# EAGLE design shield (EAGLE 8.2.2)

## Sheet 1 of 2: power
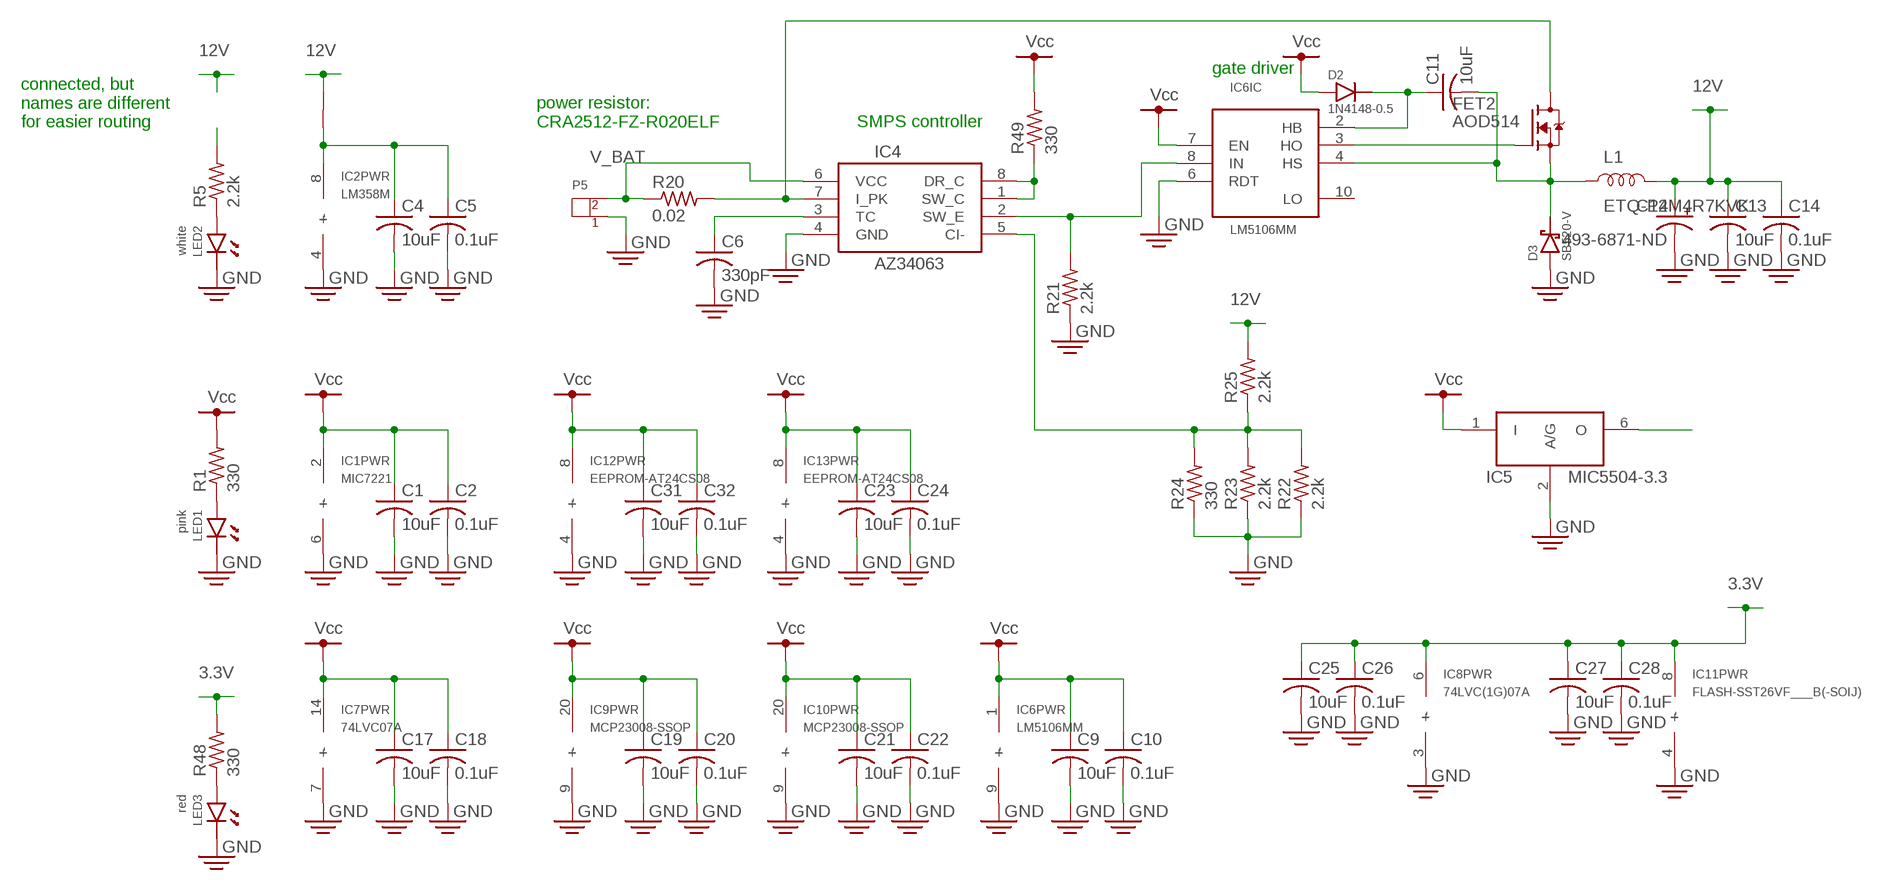
[diagram p0: schematic, sheet 1]

### Parts
-1  SEPERATOR  [SEPERATOR]
C1  10uF  C-USC0805  [C0805]
C2  0.1uF  C-USC0603  [C0603]
C4  10uF  C-USC0805  [C0805]
C5  0.1uF  C-USC0603  [C0603]
C6  330pF  C-USC0603  [C0603]
C9  10uF  C-USC0805  [C0805]
C10  0.1uF  C-USC0603  [C0603]
C11  10uF  C-USC0805  [C0805]
C12  493-6871-ND  CPOL-USE5-13  [E5-13]
C13  10uF  C-USC0805  [C0805]
C14  0.1uF  C-USC0603  [C0603]
C17  10uF  C-USC0805  [C0805]
C18  0.1uF  C-USC0603  [C0603]
C19  10uF  C-USC0805  [C0805]
C20  0.1uF  C-USC0603  [C0603]
C21  10uF  C-USC0805  [C0805]
C22  0.1uF  C-USC0603  [C0603]
C23  10uF  C-USC0805  [C0805]
C24  0.1uF  C-USC0603  [C0603]
C25  10uF  C-USC0805  [C0805]
C26  0.1uF  C-USC0603  [C0603]
C27  10uF  C-USC0805  [C0805]
C28  0.1uF  C-USC0603  [C0603]
C31  10uF  C-USC0805  [C0805]
C32  0.1uF  C-USC0603  [C0603]
D2  1N4148-0.5  [DIODE-5]
D3  SB520-V  [SB520-V]
FET2  AOD514  [TO-252]
IC1  MIC7221  [SOT23-5]
IC2  LM358M  [8-SOP]
IC4  AZ34063  [8-SOP]
IC5  MIC5504-3.3  [SOT23-5]
IC6  LM5106MM  [10-VSSOP]
IC7  74LVC07A  [14-SOP]
IC8  74LVC(1G)07A  [SOT23-5]
IC9  MCP23008-SSOP  [20-SSOP(0.65MM)]
IC10  MCP23008-SSOP  [20-SSOP(0.65MM)]
IC11  FLASH-SST26VF___B(-SOIJ)  [8-SOIJ]
IC12  EEPROM-AT24CS08  [8-SOP]
IC13  EEPROM-AT24CS08  [8-SOP]
L1  ETQ-P4M4R7KVK  INDUCTOR-ETQ___K  [INDUCTOR-ETQ__K]
LED1  pink  LED5MM  [LED5MM]
LED2  white  LED5MM  [LED5MM]
LED3  red  LED5MM  [LED5MM]
P5  CONN-2P-VL  [B02P-VL]
R1  330  R-US_R0603  [R0603]
R5  2.2k  R-US_R0603  [R0603]
R20  0.02  R-US_R2512  [R2512]
R21  2.2k  R-US_R0603  [R0603]
R22  2.2k  R-US_R0603  [R0603]
R23  2.2k  R-US_R0603  [R0603]
R24  330  R-US_R0603  [R0603]
R25  2.2k  R-US_R0603  [R0603]
R48  330  R-US_R0603  [R0603]
R49  330  R-US_R0603  [R0603]

### Nets
3.3V: C25.1 C26.1 C27.1 C28.1 IC8.6(PWR:+) IC11.8(PWR:+) R48.2 ; also sheet 2
12V [6A]: -1.P$2 C12.+ C13.1 C14.1 L1.2(B) R25.2 ; also sheet 2
GND: C1.2 C2.2 C4.2 C5.2 C6.2 C9.2 C10.2 C12.- C13.2 C14.2 C17.2 C18.2 C19.2 C20.2 C21.2 C22.2 C23.2 C24.2 C25.2 C26.2 C27.2 C28.2 C31.2 C32.2 D3.A IC1.6(PWR:-) IC2.4(PWR:-) IC4.4(GND) IC5.2(A/G) IC6.6(IC:RDT) IC6.9(PWR:-) IC7.7(PWR:-) IC8.3(PWR:-) IC9.9(PWR:-) IC10.9(PWR:-) IC11.4(PWR:-) IC12.4(PWR:-) IC13.4(PWR:-) LED1.C LED2.C LED3.C P5.1 R21.1 R22.1 R23.1 R24.1 ; also sheet 2
IO_3.3V: IC5.6(O) ; also sheet 2
N$6: LED1.A R1.1
N$8: LED2.A R5.1
N$22: C6.1 IC4.3(TC)
N$23 [2A]: FET2.TAB(D) IC4.7(I_PK) R20.2
N$24: C11.1 D2.C IC6.2(IC:HB)
N$25 [2A]: C11.2 D3.K(C) FET2.2(S) IC6.4(IC:HS) L1.1(A)
N$26: FET2.1(G) IC6.3(IC:HO)
N$27: IC4.2(SW_E) IC6.8(IC:IN) R21.2
N$28: IC4.5(CI-) R22.2 R23.2 R24.2 R25.1
N$54: LED3.A R48.1
N$55: IC4.1(SW_C) IC4.8(DR_C) R49.1
N$56: -1.P$1 C4.1 C5.1 IC2.8(PWR:+)
V_BAT [2A]: IC4.6(VCC) P5.2 R20.1 ; also sheet 2
VCC: C1.1 C2.1 C9.1 C10.1 C17.1 C18.1 C19.1 C20.1 C21.1 C22.1 C23.1 C24.1 C31.1 C32.1 D2.A IC1.2(PWR:+) IC5.1(I) IC6.1(PWR:+) IC6.7(IC:EN) IC7.14(PWR:+) IC9.20(PWR:+) IC10.20(PWR:+) IC12.8(PWR:+) IC13.8(PWR:+) R1.2 R49.2 ; also sheet 2
VIN: R5.2 ; also sheet 2
Unconnected: IC6.10(IC:LO) IC7.8(F:OUT) IC7.9(F:IN) IC7.10(E:OUT) IC7.11(E:IN)

### Notes on the sheet
- gate driver
- connected, but
  names are different
  for easier routing
- power resistor:
  CRA2512-FZ-R020ELF
- SMPS controller

## Sheet 2 of 2: cct
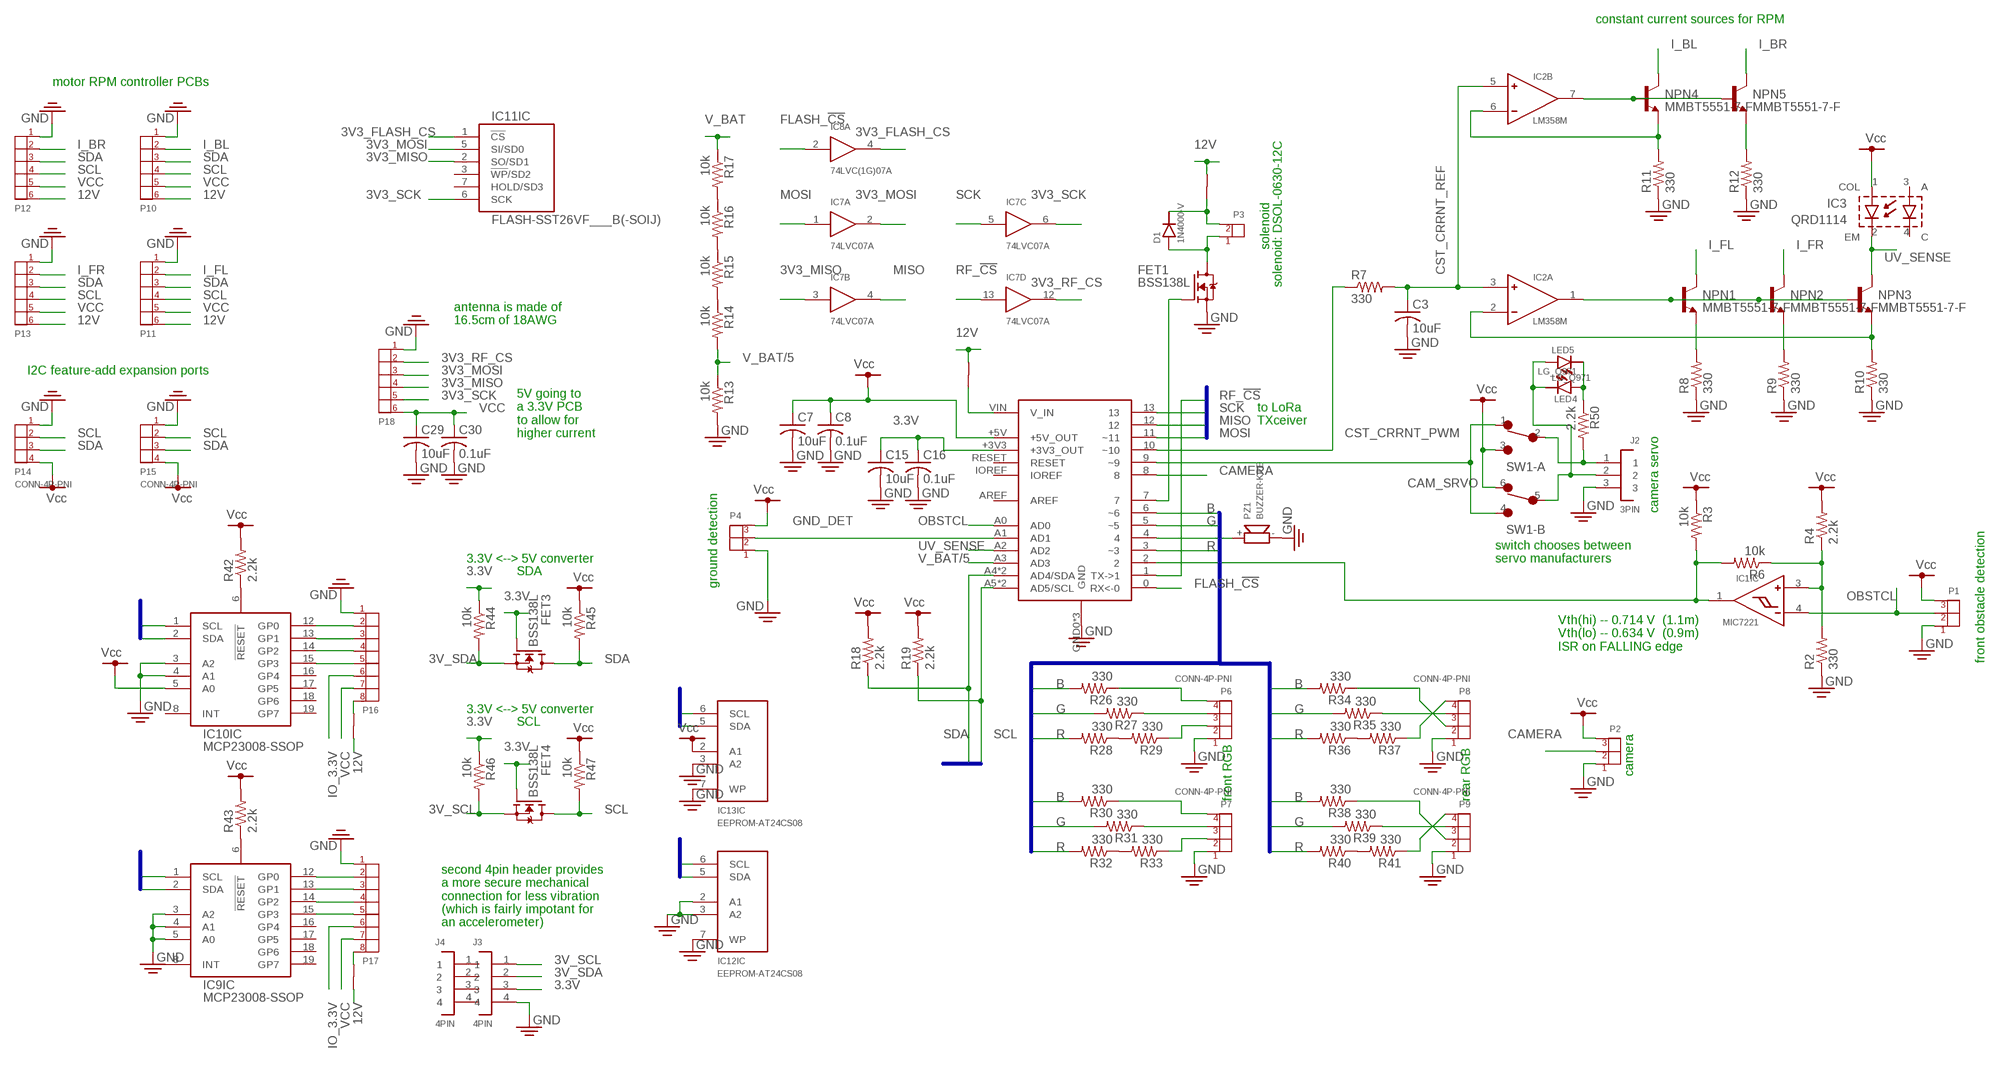
[diagram p1: schematic, sheet 2]

### Parts
-2  SEPERATOR  [SEPERATOR]
-3  SEPERATOR  [SEPERATOR]
-4  SEPERATOR  [SEPERATOR]
-5  SEPERATOR  [SEPERATOR]
C3  10uF  C-USC0805  [C0805]
C7  10uF  C-USC0805  [C0805]
C8  0.1uF  C-USC0603  [C0603]
C15  10uF  C-USC0805  [C0805]
C16  0.1uF  C-USC0603  [C0603]
C29  10uF  C-USC0805  [C0805]
C30  0.1uF  C-USC0603  [C0603]
D1  1N4000-V  [DIODE-V]
FET1  BSS138L  [SOT-23]
FET3  BSS138L  [SOT-23]
FET4  BSS138L  [SOT-23]
IC3  QRD1114  [QRD1114]
J1  ARDUINO_UNO  [ARDUINO_UNO]
J2  3PIN  [3P]
J3  4PIN  [4P]
J4  4PIN  [4P]
LED4  LG_Q971  [0603-LED]
LED5  LG_Q971  [0603-LED]
NPN1  MMBT5551-7-F  [SOT-23]
NPN2  MMBT5551-7-F  [SOT-23]
NPN3  MMBT5551-7-F  [SOT-23]
NPN4  MMBT5551-7-F  [SOT-23]
NPN5  MMBT5551-7-F  [SOT-23]
P1  CONN-3P-PNI  [B03B-PNISK]
P2  CONN-3P-PNI  [B03B-PNISK]
P3  CONN-2P-PNI  [B02B-PNISK]
P4  CONN-3P-PNI  [B03B-PNISK]
P6  CONN-4P-PNI  [B04B-PNISK]
P7  CONN-4P-PNI  [B04B-PNISK]
P8  CONN-4P-PNI  [B04B-PNISK]
P9  CONN-4P-PNI  [B04B-PNISK]
P10  CONN-6P-PNI  [B06B-PNISK]
P11  CONN-6P-PNI  [B06B-PNISK]
P12  CONN-6P-PNI  [B06B-PNISK]
P13  CONN-6P-PNI  [B06B-PNISK]
P14  CONN-4P-PNI  [B04B-PNISK]
P15  CONN-4P-PNI  [B04B-PNISK]
P16  CONN-8P-PNI  [B08B-PNISK]
P17  CONN-8P-PNI  [B08B-PNISK]
P18  CONN-6P-PNI  [B06B-PNISK]
PZ1  BUZZER-KPE  [KPE-242]
R2  330  R-US_R0603  [R0603]
R3  10k  R-US_R0603  [R0603]
R4  2.2k  R-US_R0603  [R0603]
R6  10k  R-US_R0603  [R0603]
R7  330  R-US_R0603  [R0603]
R8  330  R-US_R0603  [R0603]
R9  330  R-US_R0603  [R0603]
R10  330  R-US_R0603  [R0603]
R11  330  R-US_R0603  [R0603]
R12  330  R-US_R0603  [R0603]
R13  10k  R-US_R0603  [R0603]
R14  10k  R-US_R0603  [R0603]
R15  10k  R-US_R0603  [R0603]
R16  10k  R-US_R0603  [R0603]
R17  10k  R-US_R0603  [R0603]
R18  2.2k  R-US_R0603  [R0603]
R19  2.2k  R-US_R0603  [R0603]
R26  330  R-US_R0603  [R0603]
R27  330  R-US_R0603  [R0603]
R28  330  R-US_R0603  [R0603]
R29  330  R-US_R0603  [R0603]
R30  330  R-US_R0603  [R0603]
R31  330  R-US_R0603  [R0603]
R32  330  R-US_R0603  [R0603]
R33  330  R-US_R0603  [R0603]
R34  330  R-US_R0603  [R0603]
R35  330  R-US_R0603  [R0603]
R36  330  R-US_R0603  [R0603]
R37  330  R-US_R0603  [R0603]
R38  330  R-US_R0603  [R0603]
R39  330  R-US_R0603  [R0603]
R40  330  R-US_R0603  [R0603]
R41  330  R-US_R0603  [R0603]
R42  2.2k  R-US_R0603  [R0603]
R43  2.2k  R-US_R0603  [R0603]
R44  10k  R-US_R0603  [R0603]
R45  10k  R-US_R0603  [R0603]
R46  10k  R-US_R0603  [R0603]
R47  10k  R-US_R0603  [R0603]
R50  2.2k  R-US_R0603  [R0603]
SW1  SWITCH-DPDT-JS202011SCQN  [JS202011SCQN]

### Nets
3.3V: C15.1 C16.1 FET3.1(G) FET4.1(G) J1.+3V3(+3V3_OUT) J3.3 R44.1 R46.1 ; also sheet 1
3V3_FLASH_CS: IC8.4(A:OUT) IC11.1(IC:!CS!)
3V3_MISO: IC7.3(B:IN) IC11.2(IC:SO/SD1) P18.4
3V3_MOSI: IC7.2(A:OUT) IC11.5(IC:SI/SD0) P18.3
3V3_RF_CS: IC7.12(D:OUT) P18.2
3V3_SCK: IC7.6(C:OUT) IC11.6(IC:SCK) P18.5
3V_SCL: FET4.2(S) J3.1 R46.2
3V_SDA: FET3.2(S) J3.2 R44.2
12V [6A]: -2.P$2 -3.P$2 -4.P$1 -5.P$1 P10.6 P11.6 P12.6 P13.6 ; also sheet 1
B: J1.6(~6) R26.2 R30.2 R34.2 R38.2
CAM_SRVO: J1.9(~9) SW1.1(-A:NC) SW1.4(-B:NO)
CAMERA: J1.8 P2.2
CST_CRRNT_PWM: J1.10(~10) R7.1
CST_CRRNT_REF: C3.1 IC2.3(A:+) IC2.5(B:+) R7.2
FLASH_!CS!: IC8.2(A:IN) J1.0(RX<-0)
G: J1.5(~5) R27.2 R31.2 R35.2 R39.2
GND: C3.2 C7.2 C8.2 C15.2 C16.2 C29.2 C30.2 FET1.2(S) IC9.3(IC:A2) IC9.4(IC:A1) IC9.5(IC:A0) IC10.3(IC:A2) IC10.4(IC:A1) IC12.2(IC:A1) IC12.3(IC:A2) IC12.7(IC:WP) IC13.3(IC:A2) IC13.7(IC:WP) J1.GND0(GND) J1.GND1(GND) J1.GND2(GND) J2.3 J3.4 P1.1 P2.1 P4.1 P6.1 P7.1 P8.1 P9.1 P10.1 P11.1 P12.1 P13.1 P14.1 P15.1 P16.1 P17.1 P18.1 PZ1.- R2.1 R8.1 R9.1 R10.1 R11.1 R12.1 R13.2 ; also sheet 1
GND_DET: J1.A1(AD1) P4.2
I_BL: NPN4.3(C) P10.2
I_BR: NPN5.3(C) P12.2
I_FL: NPN1.3(C) P11.2
I_FR: NPN2.3(C) P13.2
IO_3.3V: P16.6 P17.6 ; also sheet 1
MISO: IC7.4(B:OUT) J1.12
MOSI: IC7.1(A:IN) J1.11(~11)
N$1: R28.1 R29.2
N$2: P6.2 R29.1
N$3: J2.1 R50.2 SW1.2(-A:COM)
N$4: IC1.3(IC:+) R2.2 R4.1 R6.1
N$5: IC1.1(IC:OUT) J1.2 R3.2 R6.2
N$7: J2.2 LED4.C LED5.A SW1.5(-B:COM)
N$9: IC2.1(A:OUT) NPN1.1(B) NPN2.1(B) NPN3.1(B)
N$10: IC2.7(B:OUT) NPN4.1(B) NPN5.1(B)
N$11: IC2.2(A:-) NPN3.2(E) R10.2
N$12: NPN2.2(E) R9.2
N$13: R14.1 R15.2
N$14: IC2.6(B:-) NPN4.2(E) R11.2
N$15: NPN5.2(E) R12.2
N$16: J1.4 PZ1.+
N$17: FET1.1(G) J1.7
N$18 [2A]: D1.A FET1.3(D) P3.1
N$19: NPN1.2(E) R8.2
N$20: R15.1 R16.2
N$21: R16.1 R17.2
N$29: P6.3 R27.1
N$30: P6.4 R26.1
N$31: R32.1 R33.2
N$32: P7.2 R33.1
N$33: P7.3 R31.1
N$34: P7.4 R30.1
N$35: R36.1 R37.2
N$36: P8.4 R37.1
N$37: P8.3 R35.1
N$38: P8.2 R34.1
N$39: R40.1 R41.2
N$40: P9.4 R41.1
N$41: P9.3 R39.1
N$42: P9.2 R38.1
N$43: IC9.12(IC:GP0) P17.2
N$44 [2A]: -3.P$1 D1.C P3.2
N$45: IC10.6(IC:!RESET!) R42.1
N$46: IC9.6(IC:!RESET!) R43.1
N$47: IC9.13(IC:GP1) P17.3
N$48: IC9.14(IC:GP2) P17.4
N$49: IC9.15(IC:GP3) P17.5
N$50: IC10.12(IC:GP0) P16.2
N$51: IC10.13(IC:GP1) P16.3
N$52: IC10.14(IC:GP2) P16.4
N$53: IC10.15(IC:GP3) P16.5
N$57: LED4.A LED5.C R50.1
N$58: -5.P$2 P16.8
N$59: -4.P$2 P17.8
OBSTCL: IC1.4(IC:-) J1.A0(AD0) P1.2
R: J1.3(~3) R28.2 R32.2 R36.2 R40.2
RF_!CS!: IC7.13(D:IN) J1.1(TX->1)
SCK: IC7.5(C:IN) J1.13
SCL: FET4.3(D) IC9.1(IC:SCL) IC10.1(IC:SCL) IC12.6(IC:SCL) IC13.6(IC:SCL) J1.A5(AD5/SCL) J1.SCL(AD5/SCL) P10.4 P11.4 P12.4 P13.4 P14.2 P15.2 R19.1 R47.2
SDA: FET3.3(D) IC9.2(IC:SDA) IC10.2(IC:SDA) IC12.5(IC:SDA) IC13.5(IC:SDA) J1.A4(AD4/SDA) J1.SDA(AD4/SDA) P10.3 P11.3 P12.3 P13.3 P14.3 P15.3 R18.1 R45.2
UV_SENSE: IC3.2(EM) J1.A2(AD2) NPN3.3(C)
V_BAT [2A]: R17.1 ; also sheet 1
V_BAT/5: J1.A3(AD3) R13.1 R14.2
VCC: C7.1 C8.1 C29.1 C30.1 IC3.1(COL) IC10.5(IC:A0) IC13.2(IC:A1) J1.+5V(+5V_OUT) P1.3 P2.3 P4.3 P10.5 P11.5 P12.5 P13.5 P14.4 P15.4 P16.7 P17.7 P18.6 R3.1 R4.2 R18.2 R19.2 R42.2 R43.2 R45.1 R47.1 SW1.3(-A:NO) SW1.6(-B:NC) ; also sheet 1
VIN: -2.P$1 J1.VIN(V_IN) ; also sheet 1
Unconnected: IC3.3(A) IC3.4(C) IC9.8(IC:INT) IC9.16(IC:GP4) IC9.17(IC:GP5) IC9.18(IC:GP6) IC9.19(IC:GP7) IC10.8(IC:INT) IC10.16(IC:GP4) IC10.17(IC:GP5) IC10.18(IC:GP6) IC10.19(IC:GP7) IC11.3(IC:!WP!/SD2) IC11.7(IC:HOLD/SD3) J1.AREF J1.IOREF J1.RESET J4.1 J4.2 J4.3 J4.4

### Buses
R,G,B
FLASH_!CS!,RF_!CS!,MOSI,MISO,SCK
SDA,SCL

### Notes on the sheet
- constant current sources for RPM
- motor RPM controller PCBs
- solenoid
- solenoid: DSOL-0630-12C
- antenna is made of
  16.5cm of 18AWG
- I2C feature-add expansion ports
- to LoRa
  TXceiver
- 5V going to
  a 3.3V PCB
  to allow for
  higher current
- camera servo
- 3.3V <--> 5V converter
- switch chooses between
  servo manufacturers
- SDA
- ground detection
- Vth(hi) -- 0.714 V  (1.1m)
  Vth(lo) -- 0.634 V  (0.9m)
  ISR on FALLING edge
- front obstacle detection
- 3.3V <--> 5V converter
- SCL
- camera
- front RGB | rear RGB
- second 4pin header provides
  a more secure mechanical
  connection for less vibration
  (which is fairly impotant for
  an accelerometer)

## Library data of the parts
-1--5 = Aaron SMT:SEPERATOR: seperates wide, hard-to-route power rails from thin supply traces
C1-C11 C13-C32 = rcl:C-US: CAPACITOR, American symbol
C12 = rcl:CPOL-US: POLARIZED CAPACITOR, American symbol
D1 = Aaron:1N4000
D2 = Aaron:1N4148
D3 = Aaron:SB520
FET1 FET3 FET4 = Aaron SMT:BSS138L: N.ch enhancement mode MOSFET
FET2 = Aaron SMT:AOD514
IC1 = Aaron SMT:MIC7221
IC2 = Aaron SMT:LM358
IC3 = Aaron:QRD1114
IC4 = Aaron SMT:AZ34063
IC5 = Aaron SMT:MIC5504-3.3: 3.3V regulator, 5.5V max input, 300mA output
IC6 = Aaron SMT:LM5106
IC7 = Aaron SMT:74LVC07A: hex buffer with open collector outputs
IC8 = Aaron SMT:74LVC(1G)07A
IC9 IC10 = Aaron SMT:MCP23008
IC11 = Aaron SMT:FLASH
IC12 IC13 = Aaron SMT:EEPROM: generic I2C EEPROM
J1 = Aaron Header:ARDUINO_UNO: footprint for the header pins on most simple Arduino boards, such as the Uno and Duemilanove
J2 = Aaron Header:3PIN
J3 J4 = Aaron Header:4PIN
L1 = Aaron SMT:INDUCTOR
LED1-LED3 = Aaron:LED
LED4 LED5 = Aaron SMT:LG_Q971: 0603 LED; red, orange, yellow, or green
NPN1-NPN5 = Aaron SMT:MMBT5551-7-F
P1 P2 P4 = Aaron:CONN-3P
P3 P5 = Aaron:CONN-2P
P6-P9 P14 P15 = Aaron:CONN-4P
P10-P13 P18 = Aaron:CONN-6P
P16 P17 = Aaron:CONN-8P
PZ1 = Aaron:BUZZER
R1-R50 = rcl:R-US_: RESISTOR, American symbol
SW1 = Aaron SMT:SWITCH-DPDT

## Net classes
0 default: width 0.305 mm, drill 0.406 mm, clearance 0.152 mm
1 2A: width 0.813 mm, drill 0.508 mm, clearance 0.152 mm
2 6A: width 3.556 mm, drill 0.813 mm, clearance 0.152 mm

## Board
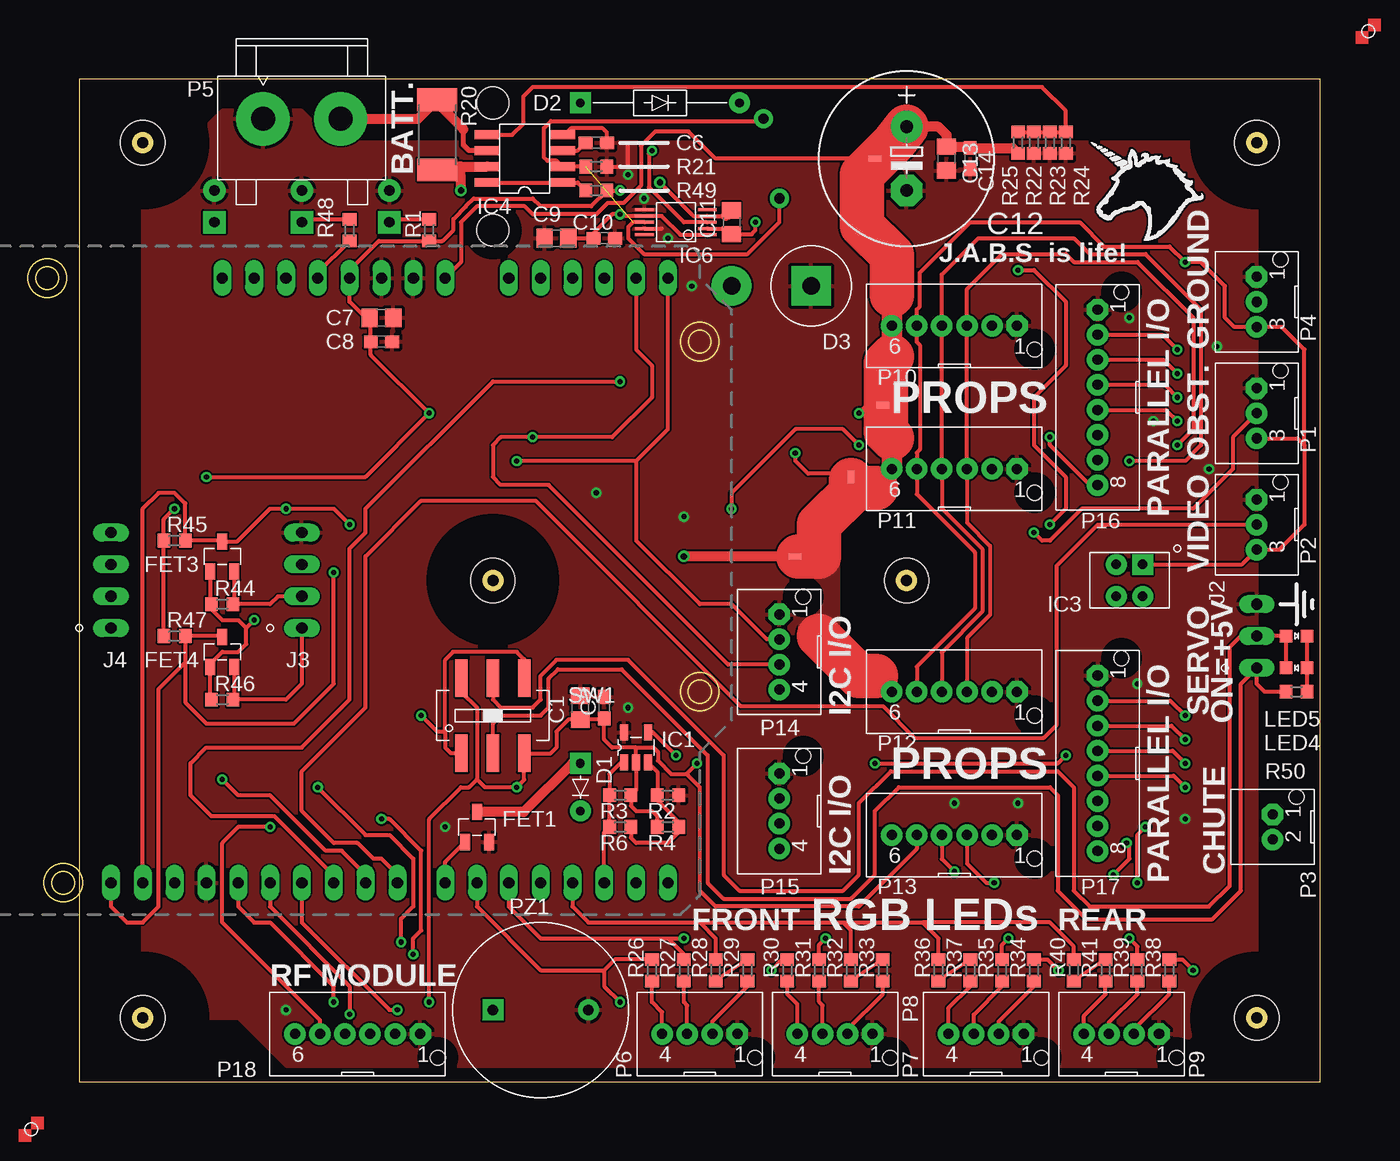
[diagram p2: board, top side]
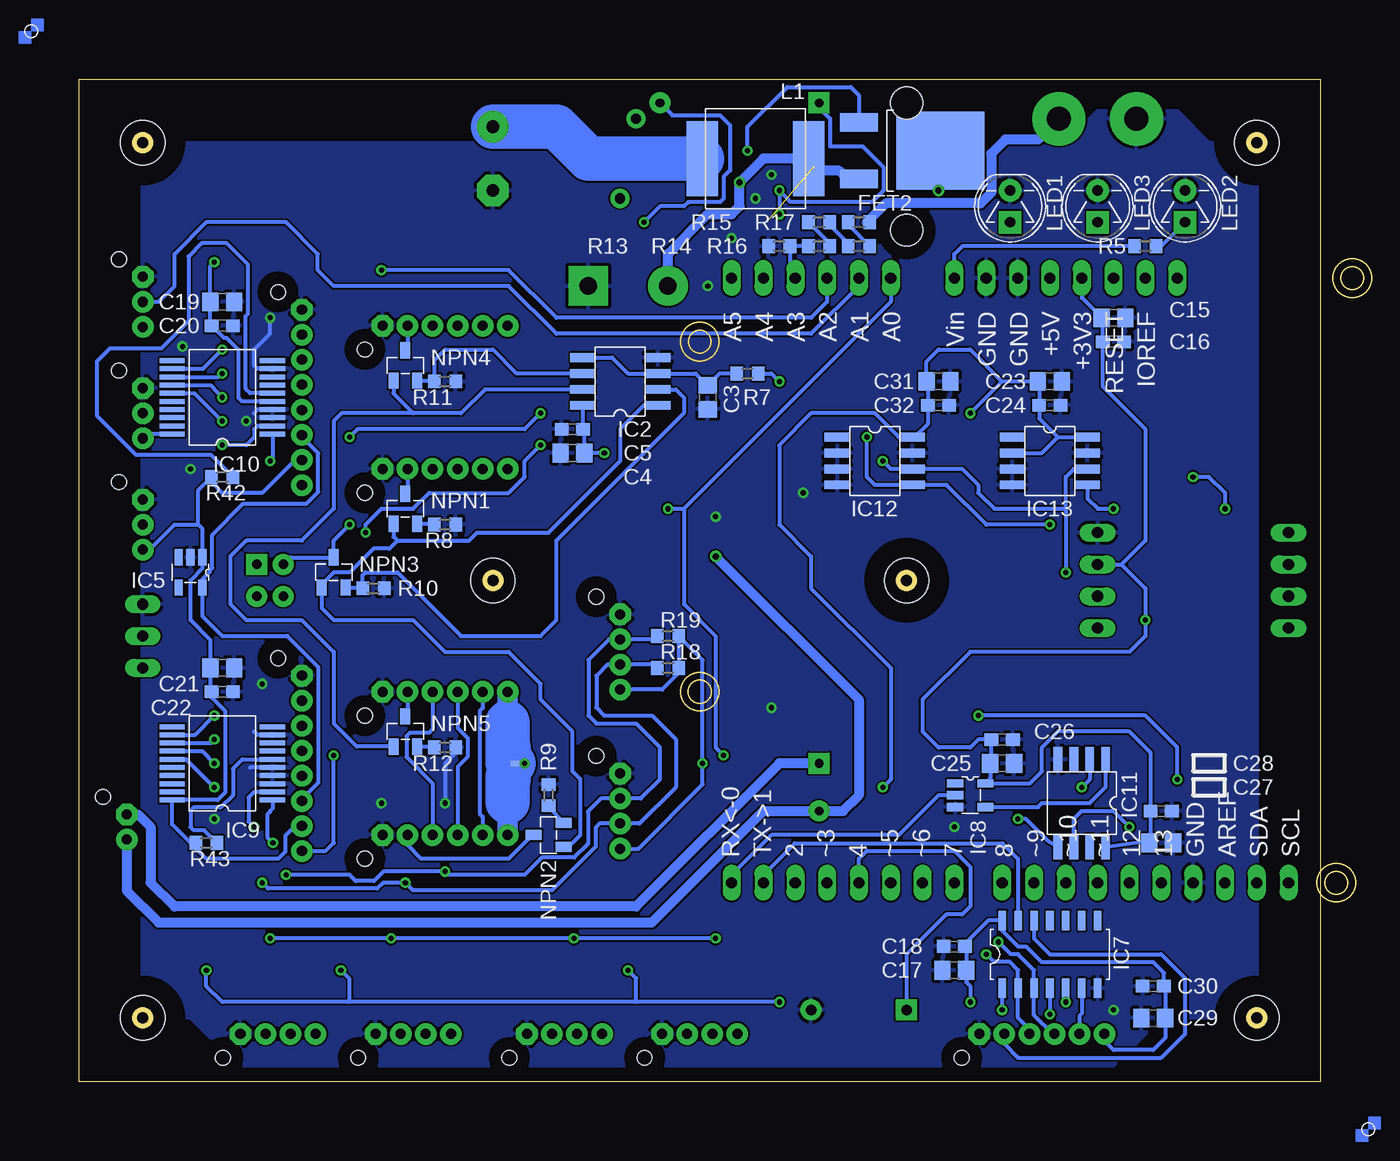
[diagram p3: board, bottom side, seen from below]

Size 99.06 x 80.01 mm. Coordinates in mm from the lower left corner, seen from the top.
Outline: 0,0 99.06,0 99.06,80.01 0,80.01 0,0
Copper layers (1*16): Top 0.035mm / dielectric 1.5mm / Bottom 0.035mm
Design rules "default": minimum track width 6mil, minimum drill 0.35mm, track to track 6mil, track to pad 6mil, pad to pad 6mil, via to via 6mil, smd to smd 6mil, copper to edge 40mil, drill to drill 6mil, minimum pad ring 10mil, minimum via ring 8mil, stop-mask expansion 4mil, vias tented up to drill 0mil, thermal gap 10mil
Holes 2.54 mm at 33.02,78.11 33.02,67.94
bKeepout: area 1.3,27.9 to 19,45.7
vRestrict: area 25.4,67.3 to 63.5,80

### Footprints (pad centres in the part's own frame; a part is rotated, then mirrored left to right if it is on the bottom)
SEPERATOR = smd 0.5 x 0.5: P$1 -0.25,0; P$2 0.25,0
C0805 = smd 1.3 x 1.5: 1 -0.95,0; 2 0.95,0
C0603 = smd 1.1 x 1: 1 -0.85,0; 2 0.85,0
E5-13 = drill 1.016 pad 2.54: + -2.54,0 | drill 1.016 pad 2.54 octagon: - 2.54,0
DIODE-V = drill 0.7 pad 1.676 square: A -1.905,0 | drill 0.7 pad 1.676: C 1.905,0
DIODE-5 = drill 0.7 pad 1.676 square: A -6.35,0 | drill 0.7 pad 1.676: C 6.35,0
SB520-V = drill 1.4 pad 3.175 square: A 0,0 | drill 1.4 pad 3.175: K 6.35,0
SOT-23 = smd 0.8 x 1.3: 1 -0.95,-1.2; 2 0.95,-1.2; 3 0,1.2
TO-252 = smd 1.5 x 3: 1 -2.25,0; 2 2.25,0 | smd 6.25 x 7: TAB 0,6.5
SOT23-5 = smd 0.65 x 1.3: 1 -0.95,-1.2; 2 0,-1.2; 3 0.95,-1.2; 4 0.95,1.2; 6 -0.95,1.2
8-SOP = smd 2 x 0.7: 1 -3,1.905; 2 -3,0.635; 3 -3,-0.635; 4 -3,-1.905; 5 3,-1.905; 6 3,-0.635; 7 3,0.635; 8 3,1.905
QRD1114 = drill 0.762 pad 1.676 square: 1 -1.054,-1.27 | drill 0.762 pad 1.676: 2 1.054,-1.27; 3 1.054,1.27; 4 -1.054,1.27
10-VSSOP = smd 0.25 x 1.5: 1 -1,-2.5; 2 -0.5,-2.5; 3 0,-2.5; 4 0.5,-2.5; 5 1,-2.5; 6 1,2.5; 7 0.5,2.5; 8 0,2.5; 9 -0.5,2.5; 10 -1,2.5
14-SOP = smd 0.6 x 1.55: 1 -3.81,-2.7; 2 -2.54,-2.7; 3 -1.27,-2.7; 4 0,-2.7; 5 1.27,-2.7; 6 2.54,-2.7; 7 3.81,-2.7; 8 3.81,2.7; 9 2.54,2.7; 10 1.27,2.7; 11 0,2.7; 12 -1.27,2.7; 13 -2.54,2.7; 14 -3.81,2.7
20-SSOP(0.65MM) = smd 2 x 0.4: 1 -4,2.925; 2 -4,2.275; 3 -4,1.625; 4 -4,0.975; 5 -4,0.325; 6 -4,-0.325; 7 -4,-0.975; 8 -4,-1.625; 9 -4,-2.275; 10 -4,-2.925; 11 4,-2.925; 12 4,-2.275; 13 4,-1.625; 14 4,-0.975; 15 4,-0.325; 16 4,0.325; 17 4,0.975; 18 4,1.625; 19 4,2.275; 20 4,2.925
8-SOIJ = smd 2 x 0.7: 1 -3.5,1.905; 2 -3.5,0.635; 3 -3.5,-0.635; 4 -3.5,-1.905; 5 3.5,-1.905; 6 3.5,-0.635; 7 3.5,0.635; 8 3.5,1.905
ARDUINO_UNO = drill 0.889 pad 1.422 long: 0 21.59,24.13; 1 19.05,24.13; 2 16.51,24.13; 3 13.97,24.13; 4 11.43,24.13; 5 8.89,24.13; 6 6.35,24.13; 7 3.81,24.13; 8 0,24.13; 9 -2.54,24.13; 10 -5.08,24.13; 11 -7.62,24.13; 12 -10.16,24.13; 13 -12.7,24.13; 20 -13.97,-24.13; +3V3 -6.35,-24.13; +5V -3.81,-24.13; A0 8.89,-24.13; A1 11.43,-24.13; A2 13.97,-24.13; A3 16.51,-24.13; A4 19.05,-24.13; A5 21.59,-24.13; AREF -17.78,24.13; GND0 -15.24,24.13; GND1 1.27,-24.13; GND2 -1.27,-24.13; IOREF -11.43,-24.13; RESET -8.89,-24.13; SCL -22.86,24.13; SDA -20.32,24.13; VIN 3.81,-24.13
3P = drill 0.889 pad 1.422 long: 1 -2.54,0; 2 0,0; 3 2.54,0
4P = drill 0.889 pad 1.422 long: 1 -3.81,0; 2 -1.27,0; 3 1.27,0; 4 3.81,0
INDUCTOR-ETQ__K = smd 2.5 x 6: 1 -4.25,0; 2 4.25,0
LED5MM = drill 0.813 pad 1.778 square: A -1.27,0 | drill 0.813 pad 1.778: C 1.27,0
0603-LED = smd 1 x 1: A -0.85,0; C 0.85,0
B03B-PNISK = drill 0.8 pad 1.714 octagon: 1 2,0 | drill 0.8 pad 1.714: 2 0,0; 3 -2,0 | hole 1.2: 3.4,-1.9
B02B-PNISK = drill 0.8 pad 1.714 octagon: 1 1,0 | drill 0.8 pad 1.714: 2 -1,0 | hole 1.2: 2.4,-1.9
B02P-VL = drill 1.9 pad 4.25: 1 3.1,0; 2 -3.1,0
B04B-PNISK = drill 0.8 pad 1.714 octagon: 1 3,0 | drill 0.8 pad 1.714: 2 1,0; 3 -1,0; 4 -3,0 | hole 1.2: 4.4,-1.9
B06B-PNISK = drill 0.8 pad 1.714 octagon: 1 5,0 | drill 0.8 pad 1.714: 2 3,0; 3 1,0; 4 -1,0; 5 -3,0; 6 -5,0 | hole 1.2: 6.4,-1.9
B08B-PNISK = drill 0.8 pad 1.714 octagon: 1 7,0 | drill 0.8 pad 1.714: 2 5,0; 3 3,0; 4 1,0; 5 -1,0; 6 -3,0; 7 -5,0; 8 -7,0 | hole 1.2: 8.4,-1.9
KPE-242 = drill 0.813 pad 1.676 square: + -3.81,0 | drill 0.813 pad 1.676: - 3.81,0
R0603 = smd 1 x 1.1: 1 -0.85,0; 2 0.85,0
R2512 = smd 1.8 x 3.2: 1 -2.8,0; 2 2.8,0
JS202011SCQN = smd 1 x 3: 1 -2.5,-3; 2 0,-3; 3 2.5,-3; 4 2.5,3; 5 0,3; 6 -2.5,3
#6-32 = hole 3.556: 0,0

### Placement (x,y rotation side)
-1  61.59,48.26 270 top
-2  63.5,73.66 0 top
-3  57.15,41.91 0 top
-4  64.14,25.4 0 bottom
-5  64.14,53.98 180 top
C1  40.01,29.84 90 top
C2  41.91,29.84 90 top
C3  48.9,54.61 270 bottom
C4  59.69,50.16 180 bottom
C5  59.69,52.07 180 bottom
C6  41.27,74.93 0 top
C7  24.13,60.96 0 top
C8  24.13,59.05 0 top
C9  38.1,67.31 180 top
C10  41.91,67.31 0 top
C11  52.07,68.58 90 top
C12  66.04,73.66 270 top
C13  69.22,73.66 270 top
C14  71.12,73.66 270 top
C15  16.51,60.96 0 bottom
C16  16.51,59.05 0 bottom
C17  29.21,8.89 180 bottom
C18  29.21,10.79 180 bottom
C19  87.63,62.23 0 bottom
C20  87.63,60.33 0 bottom
C21  87.63,33.02 0 bottom
C22  87.63,31.11 0 bottom
C23  21.59,55.88 0 bottom
C24  21.59,53.98 0 bottom
C25  25.4,25.4 0 bottom
C26  25.4,27.3 0 bottom
C27  12.7,19.05 0 bottom
C28  12.7,21.59 0 bottom
C29  13.34,5.08 180 bottom
C30  13.34,7.62 180 bottom
C31  30.48,55.88 0 bottom
C32  30.48,53.98 0 bottom
D1  40.01,23.5 270 top
D2  46.35,78.11 0 top
D3  58.42,63.5 180 top
FET1  31.75,20.32 0 top
FET2  36.83,74.3 270 bottom
FET3  11.43,41.91 0 top
FET4  11.43,34.29 0 top
IC1  44.45,26.67 0 top
IC2  55.88,55.88 180 bottom
IC3  83.82,40.01 180 top
IC4  35.56,73.66 180 top
IC5  90.17,40.64 180 bottom
IC6  47.62,68.58 90 top
IC7  21.59,10.16 0 bottom
IC8  27.94,22.86 270 bottom
IC9  87.63,25.4 180 bottom
IC10  87.63,54.61 180 bottom
IC11  19.05,22.23 270 bottom
IC12  35.56,49.53 0 bottom
IC13  21.59,49.53 0 bottom
J1  25.4,40.01 180 bottom
J2  93.98,35.56 90 top
J3  17.78,40.01 90 top
J4  2.54,40.01 90 top
L1  45.09,73.66 180 bottom
LED1  24.77,69.85 90 bottom
LED2  10.79,69.85 90 bottom
LED3  17.78,69.85 90 bottom
LED4  97.16,33.02 180 top
LED5  97.16,35.56 0 top
NPN1  73.03,45.72 0 bottom
NPN2  61.59,19.68 90 bottom
NPN3  78.74,40.64 0 bottom
NPN4  73.03,57.15 0 bottom
NPN5  73.03,27.94 0 bottom
P1  93.98,53.34 90 top
P2  93.98,44.45 90 top
P3  95.25,20.32 90 top
P4  93.98,62.23 90 top
P5  17.78,76.83 180 top
P6  49.53,3.81 0 top
P7  60.33,3.81 0 top
P8  72.39,3.81 0 top
P9  83.19,3.81 0 top
P10  69.85,60.33 0 top
P11  69.85,48.9 0 top
P12  69.85,31.11 0 top
P13  69.85,19.68 0 top
P14  55.88,34.29 90 top
P15  55.88,21.59 90 top
P16  81.28,54.61 90 top
P17  81.28,25.4 90 top
P18  22.23,3.81 0 top
PZ1  36.83,5.71 0 top
R1  27.94,67.94 270 top
R2  46.99,22.86 180 top
R3  43.18,22.86 180 top
R4  46.99,20.32 180 top
R5  13.97,66.67 180 bottom
R6  43.18,20.32 180 top
R7  45.72,56.52 180 bottom
R8  69.85,44.45 180 bottom
R9  61.59,22.86 270 bottom
R10  75.56,39.37 180 bottom
R11  69.85,55.88 180 bottom
R12  69.85,26.67 180 bottom
R13  43.18,66.67 180 bottom
R14  40.01,66.67 180 bottom
R15  40.01,68.58 180 bottom
R16  36.83,66.67 180 bottom
R17  36.83,68.58 180 bottom
R18  52.07,33.02 0 bottom
R19  52.07,35.56 0 bottom
R20  28.57,75.56 270 top
R21  41.27,73.03 180 top
R22  76.2,74.93 90 top
R23  77.47,74.93 90 top
R24  78.74,74.93 90 top
R25  74.93,74.93 270 top
R26  45.72,8.89 90 top
R27  48.26,8.89 90 top
R28  50.8,8.89 90 top
R29  53.34,8.89 90 top
R30  56.52,8.89 90 top
R31  59.05,8.89 90 top
R32  61.59,8.89 90 top
R33  64.14,8.89 90 top
R34  76.2,8.89 90 top
R35  73.66,8.89 90 top
R36  68.58,8.89 90 top
R37  71.12,8.89 90 top
R38  87,8.89 90 top
R39  84.45,8.89 90 top
R40  79.38,8.89 90 top
R41  81.92,8.89 90 top
R42  87.63,48.26 180 bottom
R43  88.9,19.05 180 bottom
R44  11.43,38.1 0 top
R45  7.62,43.18 0 top
R46  11.43,30.48 0 top
R47  7.62,35.56 0 top
R48  21.59,67.94 270 top
R49  41.27,71.12 0 top
R50  97.16,31.11 180 top
SW1  33.02,29.21 0 top
U$58  [UNICORN-SCREEN]  85.09,71.12 0 top
U$78  [UNICORN-TOP]  85.09,71.12 0 top
U$88  [#6-32]  33.02,40.01 0 top
U$112  [#6-32]  5.08,74.93 0 top
U$114  [#6-32]  93.98,74.93 0 top
U$115  [#6-32]  93.98,5.08 0 top
U$116  [#6-32]  5.08,5.08 0 top
U$117  [#6-32]  66.04,40.01 0 top
U$124  [FIDUCIAL_MARKER]  -3.81,-3.81 0 top  (outside the outline)
U$125  [FIDUCIAL_MARKER]  102.87,83.82 0 top  (outside the outline)
U$126  [JABS]  68.58,65.41 0 top

### Tracks (layer width: path | path; a pad name or v marks a point on that pad's centre or on a via)
3.3V  (via drill 0.41)
  Top 0.305: J1.+3V3 19.05,64.56 R48.2 | R46.1 10.48,30.58 FET4.1 10.48,33.34 11.43,34.29 12.7,34.29 13.34,34.92 13.34,36.2 | FET3.1 10.48,38.2 R44.1 10.58,37.68 11.43,36.83 12.7,36.83 13.34,36.2 | 13.34,36.2 v13.97,36.83
  Bottom 0.305: IC11.8 13.82,19.23 C27.1 13.55,19.15 C28.1 13.55,26.25 15.24,27.94 20.95,27.94 22.23,26.67 22.23,24.77 23.18,23.81 IC8.6 26.35,24.2 C25.1 26.25,25.5 C26.1 27.3,27.3 27.94,26.67 30.48,26.67 31.75,27.94 31.75,30.48 27.94,34.29 15.24,34.29 13.97,35.56 v13.97,36.83 13.97,39.37 15.88,41.27 | J3.3 15.88,41.27 | 15.88,41.27 13.97,43.18 13.97,52.07 17.36,55.46 C16.1 17.36,60.86 C15.1 19.05,62.55 J1.+3V3
3V3_FLASH_CS
  Bottom 0.305: IC11.1 17.14,23.5 18.41,22.23 22.23,22.23 22.54,21.91 IC8.4
3V3_MISO  (via drill 0.41)
  Top 0.305: v25.69,11.14 25.69,12.99 26.67,13.97 26.67,17.78 24.77,19.68 22.86,19.68 v19.05,23.5
  Bottom 0.305: P18.4 21.37,3.81 22.86,5.3 IC7.3 22.86,8.89 24.13,10.16 24.72,10.16 v25.69,11.14 | IC11.2 18.41,24.13 v19.05,23.5
3V3_MOSI  (via drill 0.41)
  Top 0.305: v26.67,10.16 26.67,11.43 27.3,12.06 27.3,18.41 24.77,20.95 v24.13,20.95
  Bottom 0.305: P18.3 23.23,4.17 24.13,5.08 IC7.2 24.13,8.89 24.79,9.55 26.06,9.55 v26.67,10.16 | v24.13,20.95 23.5,20.95 21.77,19.23 IC11.5
3V3_RF_CS
  Bottom 0.305: P18.2 25.23,3 24.13,1.91 12.7,1.91 10.79,3.81 10.79,8.26 12.7,10.16 21.59,10.16 22.86,11.43 IC7.12
3V3_SCK  (via drill 0.41)
  Top 0.305: P18.5 19.23,4.91 11.43,12.7 11.43,19.05 12.7,20.32 v15.24,20.32
  Bottom 0.305: P18.5 19.23,5.25 19.05,5.43 IC7.6 | IC11.6 19.68,20.95 19.05,21.59 16.51,21.59 v15.24,20.32
3V_SCL
  Top 0.305: FET4.2 12.38,30.58 R46.2 16.51,30.48 17.78,31.75 J3.1
3V_SDA
  Top 0.305: FET3.2 12.38,38.2 R44.2 | R44.2 | J3.2 15.88,38.73 15.24,38.1 R44.2
12V
  Top 0.813: C12.+ 68.58,76.2 69.22,75.56 C13.1 71.02,74.61 C14.1 74.5,74.51 R25.2
  Top 1.626: 64.85,62.78 P10.6 64.85,57.87 | 64.85,51.35 P11.6 63.58,47.37 | 63.58,32.38 P12.6
  Top 3.556: C12.+ 65.02,74.93 -2.P$2 62.48,72.39 62.48,68.33 64.85,65.96 64.85,62.78 | 61.98,47.37 63.58,47.37 | 63.58,32.38 62.23,32.38 59.05,35.56 | 61.98,47.37 59.05,44.45 59.05,41.94 59.02,41.91 -3.P$2 | -1.P$2 61.59,47.75 61.98,47.37 | 64.85,57.87 64.39,57.4 -5.P$1 64.39,51.82 64.85,51.35
  Bottom 0.406: 64.85,25.48 64.77,25.4 64.77,24.42
  Bottom 1.626: P12.6 64.85,28.66 | P13.6 64.85,22.3
  Bottom 3.556: L1.2 58.42,73.66 60.96,76.2 C12.+ | 64.85,28.66 64.85,25.48 | -4.P$1 64.77,25.4 | 64.77,25.4 64.77,26.67 | 64.77,25.4 64.77,24.13 | 64.85,22.3 64.85,24.34 64.77,24.42
  pour Top: 57.78,43.18 60.33,43.18 60.33,33.66 57.78,36.2
B  (via drill 0.41)
  Top 0.305: J1.6 31.75,13.97 36.83,8.89 41.91,8.89 | R26.2 42.76,9.74 41.91,8.89 | 41.91,8.89 41.91,7.62 v43.18,6.35 | R38.2 88.05,9.74 v88.9,8.89 | R30.2 56.09,9.74 v55.24,8.89 | R34.2 77.25,9.74 78.11,8.89 v78.17,8.89
  Bottom 0.305: v43.18,6.35 54.61,6.35 | 54.61,6.35 77.47,6.35 | 77.47,6.35 87.63,6.35 88.9,7.62 v88.9,8.89 | 54.61,6.35 54.61,8.26 v55.24,8.89 | 77.47,6.35 77.47,8.19 v78.17,8.89
CAM_SRVO  (via drill 0.41)
  Top 0.305: SW1.4 35.52,33.7 34.92,34.29 29.84,34.29 29.21,33.66 29.21,27.94 | SW1.1 29.67,26.21 29.21,26.67 29.21,27.94 | J1.9 22.86,16.51 20.95,18.41 19.68,18.41 15.24,22.86 12.7,22.86 v11.43,24.13 | v27.3,29.21 28.57,27.94 29.21,27.94
  Bottom 0.305: v11.43,24.13 11.43,26.67 13.97,29.21 v27.3,29.21
CAMERA
  Top 0.305: J1.8 25.4,16.51 24.13,17.78 23.5,17.78 22.23,19.05 20.32,19.05 17.78,21.59 17.78,24.77 22.86,29.84 22.86,41.91 27.3,46.35 36.42,46.35 52.8,29.98 64.13,29.98 66.66,27.45 76.98,27.45 78.02,28.48 78.02,41.19 81.28,44.45 P2.2
CST_CRRNT_PWM  (via drill 0.41)
  Top 0.305: J1.10 20.14,16.05 20.14,16.64 15.6,21.18 10.57,21.18 8.89,22.86 8.89,25.4 10.16,26.67 17.78,26.67 21.59,30.48 21.59,42.55 22.86,43.81 22.86,45.72 33.02,55.88 v43.18,55.88
  Bottom 0.305: R7.1 43.81,56.52 v43.18,55.88
CST_CRRNT_REF
  Bottom 0.305: IC2.5 56.52,57.78 55.24,56.52 IC2.3 49.85,56.52 C3.1 | C3.1 | R7.2 47.95,56.52 C3.1
FLASH_!CS!
  Bottom 0.305: IC8.2 30.48,22.86 33.66,19.68 43.81,19.68 46.99,16.51 J1.0
G  (via drill 0.41)
  Top 0.305: J1.5 34.29,13.97 36.83,11.43 46.99,11.43 | 46.99,11.43 48.26,10.16 R27.2 | 46.99,11.43 v48.26,11.43 | R39.2 84.45,10.79 v83.82,11.43 | R31.2 59.05,10.91 v59.58,11.43 | R35.2 73.66,10.93 v74.16,11.43
  Bottom 0.305: v48.26,11.43 v59.58,11.43 v74.16,11.43 v83.82,11.43
GND  (via drill 0.41)
  Top 0.305: R21.1 43.81,73.03 43.81,74.93 | IC6.9 46.49,68.08 | IC4.4 38.73,75.56 39.24,76.07 41.78,76.07 42.12,75.73 C6.2
  Bottom 0.305: IC10.4 84.8,53.63 85.09,53.34 | IC9.9 84.83,27.68 85.09,27.94 | IC9.5 85.42,25.07 | R12.1 69,26.25 69.85,25.4 v69.85,22.23 | IC10.9 84.83,56.88 85.09,57.15 85.09,58.42 83.82,59.69 v83.82,60.96
  other vias: 45.09,70.48 46.99,67.31 43.81,72.39 16.51,5.71 43.81,29.84 41.27,46.99 48.26,45.09 88.27,20.95 74.93,22.23 85.72,52.7 90.17,48.9 90.81,58.67 84.45,31.75 29.21,20.32 48.9,63.5
  pour Top: 5.08,74.93 5.08,5.08 12.7,5.08 16.51,1.27 86.36,1.27 90.17,5.08 93.98,5.08 93.98,74.93 20.32,74.93 17.78,77.47 11.43,77.47 8.89,74.93
  pour Bottom: 93.98,5.08 93.98,74.93 20.32,74.93 17.78,77.47 11.43,77.47 8.89,74.93 5.08,74.93 5.08,5.08 12.7,5.08 16.51,1.27 86.36,1.27 90.17,5.08
GND_DET
  Bottom 0.305: J1.A1 36.83,63.5 40.64,59.69 60.96,59.69 64.77,63.5 78.74,63.5 80.01,64.77 80.01,66.04 82.55,68.58 88.9,68.58 91.44,66.04 91.44,63.5 92.71,62.23 P4.2
I_BL
  Bottom 0.305: P10.2 72.85,58.52 NPN4.3
I_BR
  Bottom 0.305: P12.2 72.85,29.32 NPN5.3
I_FL
  Bottom 0.305: P11.2 72.85,47.09 NPN1.3
I_FR
  Bottom 0.305: P13.2 72.85,18.88 71.75,17.78 64.77,17.78 62.87,19.68 NPN2.3
IO_3.3V
  Bottom 0.305: P16.6 81.28,51.47 79.97,50.15 79.97,47.07 80.91,46.13 85.95,46.13 88.44,43.64 88.44,41 88.61,40.83 88.61,40.71 88.61,40.7 88.78,40.53 89.22,40.09 IC5.6 89.22,37.15 87.63,35.56 87.62,35.57 82.45,35.57 79.97,33.09 79.97,23.86 81.28,22.54 P17.6
MISO  (via drill 0.41)
  Top 0.305: v21.59,5.38 21.59,7.62 15.24,13.97 J1.12
  Bottom 0.305: IC7.4 v21.59,5.38
MOSI  (via drill 0.41)
  Top 0.305: J1.11 17.78,12.7 24.77,5.71 v25.4,5.71
  Bottom 0.305: IC7.1 v25.4,5.71
N$1
  Top 0.305: R29.2 R28.1
N$2
  Top 0.305: R29.1 53.34,7.62 50.53,4.81 P6.2
N$3
  Top 0.305: R50.2 94.61,31.11 93.98,31.75 J2.1 92.71,31.75 92.71,15.24 90.42,12.95 80.39,12.95 78.11,15.24 78.11,22.86 77.47,23.5 65.41,23.5 63.5,21.59 63.5,16.51 61.59,14.61 51.44,14.61 50.16,15.88 50.16,26.04 43.29,32.91 38.21,32.91 37.47,32.16 37.47,29.84 36.83,29.21 33.66,29.21 33.02,28.57 SW1.2
N$4
  Top 0.305: IC1.3 46.14,24.73 R2.2 46.14,22.44 47.84,20.74 R4.1 47.84,19.9 46.99,19.05 44.45,19.05 44.03,19.47 R6.1
N$5
  Top 0.305: J1.2 41.91,19.9 R6.2 R3.2 42.33,24.55 43.25,25.47 IC1.1
N$6
  Top 0.305: R1.1 24.98,68.8 LED1.A
N$7
  Top 0.305: LED4.C LED5.A J2.2 92.71,35.56 91.82,34.67 91.82,15.62 90.17,13.97 80.64,13.97 79.38,15.24 79.38,23.5 78.11,24.77 64.77,24.77 62.23,22.23 62.23,16.51 60.96,15.24 52.7,15.24 51.44,16.51 51.44,26.04 43.81,33.66 38.1,33.66 36.83,32.38 36.83,30.48 36.2,29.84 33.66,29.84 33.02,30.48 SW1.5
N$8
  Bottom 0.305: R5.1 12.7,66.67 LED2.A
N$9
  Bottom 0.305: IC2.1 53.98,53.98 55.88,52.07 55.88,49.53 61.59,43.81 67.3,43.81 67.94,43.18 73.66,43.18 | NPN1.1 73.97,43.49 73.66,43.18 | 73.66,43.18 74.3,42.55 75.56,42.55 77.47,40.64 78.74,40.64 79.69,39.69 NPN3.1 79.69,37.78 78.74,36.83 72.39,36.83 69.85,34.29 64.77,34.29 62.23,31.75 62.23,30.48 59.69,27.94 59.69,24.77 59.05,24.13 59.05,19.68 59.69,19.05 60.01,18.73 NPN2.1
N$10
  Bottom 0.305: IC2.7 66.67,55.24 68.58,53.34 72.39,53.34 | NPN4.1 73.97,54.92 72.39,53.34 | 72.39,53.34 78.11,53.34 78.74,52.7 78.74,45.72 81.28,43.18 85.72,43.18 87,41.91 87,38.1 85.72,36.83 81.28,36.83 78.74,34.29 78.74,28.57 76.91,26.74 NPN5.1
N$11
  Bottom 0.305: NPN3.2 76.48,39.44 R10.2 76.42,40.42 76.2,40.64 73.66,40.64 68.58,35.56 62.23,35.56 60.96,36.83 60.96,43.18 50.8,53.34 50.8,54.61 51.44,55.24 IC2.2
N$12
  Bottom 0.305: R9.2 61.59,21.98 NPN2.2
N$13
  Bottom 0.305: R14.1 39.16,66.88 R15.2
N$14
  Bottom 0.305: NPN4.2 70.77,55.95 R11.2 70.7,57.57 69.85,58.42 66.04,58.42 64.14,56.52 IC2.6
N$15
  Bottom 0.305: NPN5.2 70.77,26.74 R12.2
N$16
  Bottom 0.305: J1.4 36.83,17.78 36.2,18.41 29.21,18.41 27.94,17.14 27.94,13.97 28.57,13.34 29.84,13.34 33.02,10.16 PZ1.+
N$17
  Top 0.305: J1.7 29.21,17.53 FET1.1
N$18
  Top 0.813: FET1.3 35.49,21.52 39.37,25.4 D1.A
  Bottom 0.813: P3.1 94.34,21.32 93.34,20.32 93.34,15.88 91.44,13.97 54.61,13.97 43.18,25.4 D1.A
N$19
  Bottom 0.305: NPN1.2 70.77,44.52 R8.2
N$20
  Bottom 0.305: R16.2 37.68,66.89 39.37,68.58 R15.1
N$21
  Bottom 0.305: R17.2 37.68,68.38 R16.1
N$22
  Top 0.305: IC4.3 39.79,74.3 C6.1
N$23  (via drill 0.51)
  Top 0.813: 30.45,73.03 IC4.7 | 30.45,73.03 28.95,73.03 R20.2 | v30.48,71.12 30.48,71.72 30.45,73.03
  Bottom 0.813: FET2.TAB 30.33,71.27 v30.48,71.12
N$24  (via drill 0.41)
  Top 0.305: IC6.2 51.62,68.08 C11.1 53.66,67.63 53.98,67.94 v53.98,68.58
  Bottom 0.305: D2.C 51.72,77.12 47.9,77.12 47.1,76.32 47.1,72.73 47.63,72.21 47.63,70.47 47.9,70.2 50.45,70.2 50.8,69.85 52.7,69.85 v53.98,68.58
N$25  (via drill 0.51)
  Top 0.305: v46.35,71.75 49.03,69.08 IC6.4 51.62,69.08
  Top 0.813: 51.62,69.08 C11.2
  Bottom 0.813: D3.K 52.07,66.04 48.9,69.22 46.99,69.22 46.35,69.85 v46.35,71.75 44.45,73.66 L1.1 39.91,72.68 38.39,72.68 37.76,72.05 FET2.2
N$26  (via drill 0.41)
  Top 0.305: IC6.3 48.26,68.58 45.47,71.37 45.47,74.04 v45.72,74.3
  Bottom 0.305: v45.72,74.3 45.72,76.2 42.55,79.38 37.47,79.38 36.83,78.74 FET2.1
N$27  (via drill 0.81 pad 1.52)  (1 unrouted)
  Top 0.305: R21.2 IC4.2 38.1,73.49 37.37,73.49 37.1,73.76 37.1,76.1 37.66,76.66 54.43,76.66 v54.61,76.83 | IC6.8 44.2,68.58 43.81,68.2 43.81,67.31 45.09,66.04 53.34,66.04 55.88,68.58 v55.88,70.48
N$28
  Top 0.305: IC4.5 34.56,75.56 35.46,76.46 35.46,78.64 36.2,79.38 76.83,79.38 78.74,77.47 R24.2 R23.2 R22.2 R25.1
N$29
  Top 0.305: R27.1 48.26,6.35 48.53,6.08 P6.3
N$30
  Top 0.305: R26.1 45.72,6.35 46.53,5.54 P6.4
N$31
  Top 0.305: R33.2 R32.1
N$32
  Top 0.305: R33.1 64.14,6.99 61.33,4.17 P7.2
N$33
  Top 0.305: R31.1 59.05,6.35 59.33,6.08 P7.3
N$34
  Top 0.305: R30.1 56.52,6.99 57.33,6.17 P7.4
N$35
  Top 0.305: R37.2 R36.1
N$36
  Top 0.305: R37.1 71.12,7.62 69.39,5.89 P8.4
N$37
  Top 0.305: R35.1 73.66,7.62 71.39,5.35 P8.3
N$38
  Top 0.305: R34.1 76.2,7.62 73.39,4.81 P8.2
N$39
  Top 0.305: R41.2 R40.1
N$40
  Top 0.305: R41.1 81.92,6.99 80.19,5.25 P9.4
N$41
  Top 0.305: R39.1 84.45,6.99 82.19,4.71 P9.3
N$42
  Top 0.305: R38.1 87,6.99 84.19,4.17 P9.2
N$43  (via drill 0.41)
  Top 0.305: P17.2 87.08,30.4 v88.27,29.21
  Bottom 0.305: IC9.12 89.8,27.68 v88.27,29.21
N$44  (via drill 0.51)
  Top 0.813: -3.P$1 v48.26,41.91
  Bottom 0.813: P3.2 95.25,15.24 92.71,12.7 53.34,12.7 44.45,21.59 D1.C 38.1,21.59 36.83,22.86 36.83,30.48 v48.26,41.91
N$45
  Bottom 0.305: IC10.6 85.42,54.94 85.75,55.27 85.75,61.11 85.57,61.29 85.57,65.2 87.27,66.9 89.26,66.9 90.32,65.84 90.32,60.69 92.5,58.51 96.61,58.51 97.65,57.47 97.65,53.15 94.52,50.03 88.55,50.03 R42.1
N$46
  Bottom 0.305: IC9.6 86.03,25.73 86.78,24.98 86.78,22.85 87.76,21.86 89.89,21.86 90.17,21.59 90.17,20.32 89.91,20.06 89.06,20.06 R43.1
N$47  (via drill 0.41)
  Top 0.305: P17.3 87.17,28.4 v88.27,27.3
  Bottom 0.305: IC9.13 88.55,27.02 v88.27,27.3
N$48  (via drill 0.41)
  Top 0.305: P17.4 87.27,26.4 v88.27,25.4
  Bottom 0.305: IC9.14 89.24,26.38 v88.27,25.4
N$49  (via drill 0.41)
  Top 0.305: P17.5 87.36,24.4 v88.27,23.5
  Bottom 0.305: IC9.15 90.5,25.73 v88.27,23.5
N$50  (via drill 0.41)
  Top 0.305: P16.2 86.44,59.61 v87.63,58.42
  Bottom 0.305: IC10.12 89.17,56.88 v87.63,58.42
N$51  (via drill 0.41)
  Top 0.305: P16.3 86.53,57.61 v87.63,56.52
  Bottom 0.305: IC10.13 87.91,56.23 v87.63,56.52
N$52  (via drill 0.41)
  Top 0.305: P16.4 86.63,55.61 v87.63,54.61
  Bottom 0.305: IC10.14 88.56,55.59 v87.63,54.61
N$53  (via drill 0.41)
  Top 0.305: P16.5 86.72,53.61 v87.63,52.7
  Bottom 0.305: IC10.15 89.86,54.94 v87.63,52.7
N$54
  Top 0.305: R48.1 18,68.8 LED3.A
N$55
  Top 0.305: R49.1 39.79,71.75 IC4.1 IC4.8
N$56  (via drill 0.41)
  Top 0.305: -1.P$1 58.17,48.51 57.15,49.53 v57.15,50.16
  Bottom 0.305: IC2.8 58.84,53.94 C5.1 58.74,51.97 C4.1 v57.15,50.16
N$57
  Top 0.305: LED5.C LED4.A R50.1
N$58  (via drill 0.41)
  Top 0.305: -5.P$2 62.87,53.98 v62.23,53.34 | P16.8 80.66,47.61 77.47,50.8 v77.47,51.44
  Bottom 0.305: v62.23,53.34 63.5,52.07 76.83,52.07 v77.47,51.44
N$59  (via drill 0.41)
  Top 0.305: v63.5,25.4 78.11,25.4 v78.74,26.04
  Bottom 0.305: -4.P$2 v63.5,25.4 | v78.74,26.04 78.74,19.05 79.39,18.4 P17.8
OBSTCL  (via drill 0.41)
  Top 0.305: IC1.4 45.79,27.87 v47.62,26.04 | v52.07,45.72 52.07,46.99 57.15,52.07 60.96,52.07 v62.23,50.8 | v76.2,43.81 76.83,43.18 77.47,43.18 80.01,45.72 88.9,45.72 92.08,48.9 92.08,51.44 P1.2
  Bottom 0.305: J1.A0 34.29,62.23 50.8,45.72 | 50.8,45.72 50.8,38.1 48.26,35.56 48.26,26.67 v47.62,26.04 | v62.23,50.8 63.5,49.53 63.5,48.26 64.77,46.99 71.12,46.99 72.39,45.72 74.93,45.72 76.2,44.45 v76.2,43.81 | v52.07,45.72 50.8,45.72
R
  Top 0.305: J1.3 39.37,13.97 40.64,12.7 49.53,12.7 | 49.53,12.7 50.8,11.43 R28.2 | 49.53,12.7 60.96,12.7 | R32.2 61.59,12.06 60.96,12.7 | 60.96,12.7 67.31,12.7 | 67.31,12.7 68.58,11.43 R36.2 | 67.31,12.7 77.47,12.7 79.38,10.79 R40.2
RF_!CS!
  Bottom 0.305: J1.1 44.45,16.51 41.94,19.02 25.38,19.02 24.13,17.78 IC7.13
SCK  (via drill 0.41)
  Top 0.305: v20.32,6.35 20.32,7.62 15.24,12.7 13.97,12.7 12.7,13.97 J1.13
  Bottom 0.305: IC7.5 v20.32,6.35
SCL  (via drill 0.41)
  Top 0.305: P12.4 68.85,34.27 72.08,37.5 72.08,42.51 68.85,45.74 P11.4 P10.4 68.85,64.41 71.75,67.31 79.38,67.31 80.64,66.04 85.09,66.04 89.53,61.59 89.53,50.8 88.27,49.53 v83.82,49.53 | FET4.3 11.36,35.56 R47.2 8.47,33.44 | J1.SCL 2.54,13.97 3.81,12.7 5.08,12.7 6.35,13.97 6.35,31.32 8.47,33.44 | 8.47,33.44 8.47,30.27 10.16,28.57 17.14,28.57 20.32,31.75 v20.32,40.64 | J1.A5 46.99,52.07 44.45,49.53 | 44.45,49.53 v34.92,49.53 | P14.2 54.88,35.29 52.07,38.1 49.53,38.1 44.45,43.18 44.45,49.53 | P13.4 68.85,17.76 v69.85,16.76 | v82.55,16.51 83.82,17.78 83.82,19.05 v83.59,19.05
  Bottom 0.305: P12.4 68.85,28.22 68.04,27.41 68.04,25.93 68.85,25.12 P13.4 | IC13.6 19.68,48.9 20.32,48.26 20.32,45.82 | 20.32,45.82 v20.32,40.64 | 20.32,45.82 20.42,45.72 26.04,45.72 27.3,46.99 27.3,47.62 28.57,48.9 IC12.6 34.29,48.9 v34.92,49.53 | R19.1 53.19,35.29 P14.2 56.78,35.29 58.42,33.66 58.42,29.21 57.78,28.57 54.61,28.57 52.7,26.67 52.7,24.13 54.24,22.59 P15.2 57.42,22.59 58.45,21.57 58.45,18.99 59.56,17.88 62.13,17.88 63.5,16.51 69.6,16.51 v69.85,16.76 74.77,16.76 75.52,16.02 76.98,16.02 77.48,16.51 v82.55,16.51 | IC10.1 83.63,49.72 v83.82,49.53 | IC9.1 83.63,21.78 83.82,21.59 83.82,21.54 84.05,21.31 84.05,19.51 v83.59,19.05
SDA  (via drill 0.41)
  Top 0.305: P12.3 70.85,35.4 72.69,37.25 72.69,42.76 70.85,44.61 P11.3 P10.3 70.85,63.23 73.66,66.04 78.74,66.04 79.38,65.41 84.45,65.41 88.9,60.96 88.9,52.07 v87.63,50.8 | J1.SDA 5.08,45.72 6.35,46.99 7.62,46.99 8.47,46.14 R45.2 11.36,43.18 FET3.3 12.63,43.11 15.24,45.72 v16.51,45.72 20.32,45.72 v21.59,44.45 | J1.A4 44.45,58.42 45.72,57.15 45.72,54.61 42.55,51.44 v36.2,51.44 33.66,51.44 33.02,50.8 33.02,48.26 33.66,47.62 37.47,47.62 51.8,33.29 P14.3 | P13.3 70.85,17.41 72.39,15.88 v73.03,15.88 | v84.45,15.88 84.45,19.68 v85.09,20.32
  Bottom 0.305: P12.3 70.85,28.14 71.15,27.85 72.66,27.85 72.93,27.58 72.93,25.9 70.85,23.82 P13.3 | v16.51,45.72 17.78,45.72 18.59,46.53 IC13.5 | v21.59,44.45 26.67,44.45 29.84,47.62 IC12.5 35.56,47.62 36.2,48.26 v36.2,51.44 | R18.1 53.19,33.29 P14.3 56.88,33.29 57.78,32.38 57.78,29.84 57.15,29.21 53.34,29.21 51.44,27.3 51.44,23.5 54.34,20.59 P15.3 57.52,20.59 57.84,20.27 57.84,18.74 61.31,15.27 72.42,15.27 v73.03,15.88 74.8,15.88 75.27,15.41 83.99,15.41 v84.45,15.88 | IC10.2 84.83,52.34 85.09,52.07 85.09,51.44 85.72,50.8 v87.63,50.8 | v85.09,20.32 85.53,20.77 85.53,22.67 85.08,23.12 IC9.2
UV_SENSE  (via drill 0.41)
  Top 0.305: v77.47,44.45 78.74,45.72 78.74,48.26 76.2,50.8 76.2,54.61 78.74,57.15 78.74,62.23 76.2,64.77 v74.93,64.77
  Bottom 0.305: IC3.2 82.2,41.84 NPN3.3 78.74,43.18 v77.47,44.45 | J1.A2 39.37,62.23 40.64,60.96 60.96,60.96 64.77,64.77 v74.93,64.77
V_BAT
  Top 0.406: IC4.6 31.11,74.3 30.68,74.73 30.68,76
  Top 0.813: P5.2 27.05,76.83 R20.1 28.57,78.11 30.68,76
  Bottom 0.813: R17.1 36.2,68.58 34.67,70.1 27.11,70.1 26.27,70.94 26.27,74.06 25.14,75.19 22.53,75.19 P5.2
V_BAT/5
  Bottom 0.305: R14.2 R13.1 42.33,64.56 J1.A3
VCC  (via drill 0.41)
  Top 0.305: IC6.1 47.99,67.58 46.49,69.08 IC6.7 43.31,69.08 v43.18,69.22 42.55,69.22 41.06,67.73 C10.1 C9.1 | v43.18,71.12 R49.2 40.85,69.85 36.83,69.85 36.2,70.48 31.5,70.48 30.86,69.85 30.86,69.82 29.87,68.83 29.87,67.97 29,67.09 R1.2 23.91,67.09 21.59,64.77 J1.+5V 21.59,62.23 22.86,60.96 C7.1 23.28,60.86 C8.1 23.28,58 v27.94,53.34 22.86,48.26 v10.16,48.26 | R4.2 46.14,21.17 45.72,21.59 44.45,21.59 44.03,22.01 R3.1 44.45,23.28 IC1.2 44.45,26.67 | 31.75,24.13 32.38,23.5 v34.92,23.5 35.52,24.09 SW1.3 37.64,26.21 38.1,26.67 38.1,27.94 39.05,28.89 C1.1 41.81,28.89 C2.1 41.91,27.3 42.55,26.67 44.45,26.67 | 31.75,24.13 31.75,29.84 30.52,31.07 SW1.6 | 31.75,24.13 31.11,23.5 30.48,23.5 27.94,20.95 v27.94,6.35 | P12.5 66.85,33.13 71.48,37.75 71.48,42.26 66.85,46.88 P11.5 66.85,50.19 67.08,50.43 67.08,58.79 66.85,59.03 P10.5 66.85,61.62 67.08,61.86 67.08,64.55 71.12,68.58 79.85,68.58 81.78,66.65 87.02,66.65 v88.27,65.41 89.53,65.41 91.44,63.5 91.44,60.96 92.17,60.23 P4.3 95.98,60.23 97.79,58.42 97.79,50.8 | P13.5 66.85,18.59 62.23,13.97 50.8,13.97 49.53,15.24 49.53,23.5 48.58,24.45 | 48.58,24.45 48.49,24.54 47.27,24.54 46.18,25.62 46.18,26.31 45.82,26.67 44.45,26.67 | R47.1 R45.1 6.77,44.88 v7.61,45.72 | 48.58,24.45 48.58,24.68 v49.3,25.4 | 97.79,50.8 97.79,44.45 95.79,42.45 P2.3 92.81,41.27 IC3.1 | P1.3 97.25,51.34 97.79,50.8
  Bottom 0.305: v43.18,69.22 v43.18,71.12 42.54,70.48 42.54,70.47 42.27,70.2 35.78,70.2 34.87,71.11 34.87,72.98 36.53,74.64 39.13,74.64 39.13,76.85 40.01,77.73 D2.A | P18.6 17.23,3.25 16.51,2.54 13.34,2.54 12.38,3.49 C29.1 12.38,7.52 C30.1 12.48,8.68 13.34,9.53 22.23,9.53 23.5,10.79 24.13,10.79 25.4,12.06 IC7.14 26.51,12.86 28.36,11.01 C18.1 28.26,10.7 C17.1 28.26,7.94 27.94,7.62 v27.94,6.35 | P12.5 66.85,29.82 67.08,29.58 67.08,21.38 66.85,21.14 P13.5 | v7.61,45.72 7.61,46.98 8.89,48.26 v10.16,48.26 | 27.65,53.34 27.8,53.48 v27.94,53.34 25.4,55.88 | 20.95,51.44 IC13.8 | 20.95,51.44 22.44,52.92 C24.1 22.44,55.78 C23.1 25.4,55.88 | 25.4,55.88 27.94,58.42 30.48,58.42 31.43,57.47 C31.1 31.33,55.78 C32.1 31.33,52.49 32.38,51.44 IC12.8 33.66,51.44 35.56,53.34 40.64,53.34 43.18,50.8 43.18,44.45 40.64,41.91 40.64,39.37 34.29,33.02 34.29,24.13 v34.92,23.5 | P15.4 54.44,18.59 49.3,23.72 v49.3,25.4 49.3,33.64 R19.2 R18.2 51.22,32.6 52.53,31.29 P14.4 | IC13.2 22.23,50.16 20.95,51.44 | P2.3 93.44,42.45 91.44,44.45 89.54,44.45 | 89.54,44.45 89.22,44.13 IC5.1 89.22,40.96 90.17,40.01 90.17,36.83 88.58,35.24 C21.1 88.58,31.21 C22.1 88.48,30.65 87.4,29.57 87.4,23.09 88.02,22.48 IC9.20 91.63,20.51 90.17,19.05 R43.2 89.75,18.63 88.9,17.78 83.19,17.78 82.59,18.37 82.59,19.64 81.83,20.4 P17.7 | v88.27,65.41 88.58,65.09 C19.1 88.58,60.42 C20.1 87.52,59.37 87.31,59.37 86.36,58.42 86.36,54.61 86.03,54.28 IC10.5 | 89.54,44.45 89.54,47.2 R42.2 88.48,47.84 87.63,46.99 84.45,46.99 81.83,49.61 P16.7 | IC10.20 93.64,51.69 P1.3
VIN
  Top 0.305: -2.P$1 50.8,73.66 48.64,75.82 45.97,75.82 44.83,74.68 44.83,71.49 43.45,70.11 42.17,70.11 41.27,69.22 36.2,69.22 35.56,69.85 31.75,69.85 30.48,68.58 30.48,65.41 J1.VIN
  Bottom 0.305: R5.2 28.57,66.67 29.21,66.04 J1.VIN

### Text on the board
tPlace: BATT. | GROUND | PROPS | OBST. | PARALLEL I/O | VIDEO | I2C I/O | SERVO | ON=+5V | PROPS | I2C I/O | CHUTE | PARALLEL I/O | FRONT | RGB LEDs | REAR | RF MODULE